# Altium project FMC_Delay_1ns_4Cha.PrjPcb (part 2 of 3)

## Sheet TDC.SchDoc: TDC
size 420 x 297 mm; CheckedBy: -; CompanyName: CERN; DrawnBy: GK; Organization: CERN; Address1: European Organization for Nuclear Research; Address2: CH-1211 Genève 23 - Switzerland; Revision: -; SheetNumber: 7; SheetTotal: 9; EDA_Number: EDA-XXXXX-VX-X; Projet: FMC Delay 1ns 4cha; ModifiedBy: -; CreateDate: XX/XX/XXXX; CheckedDate: -; Title2: Title2; DivGrp: BE-CO; Designer: GK; ModifiedDate: -
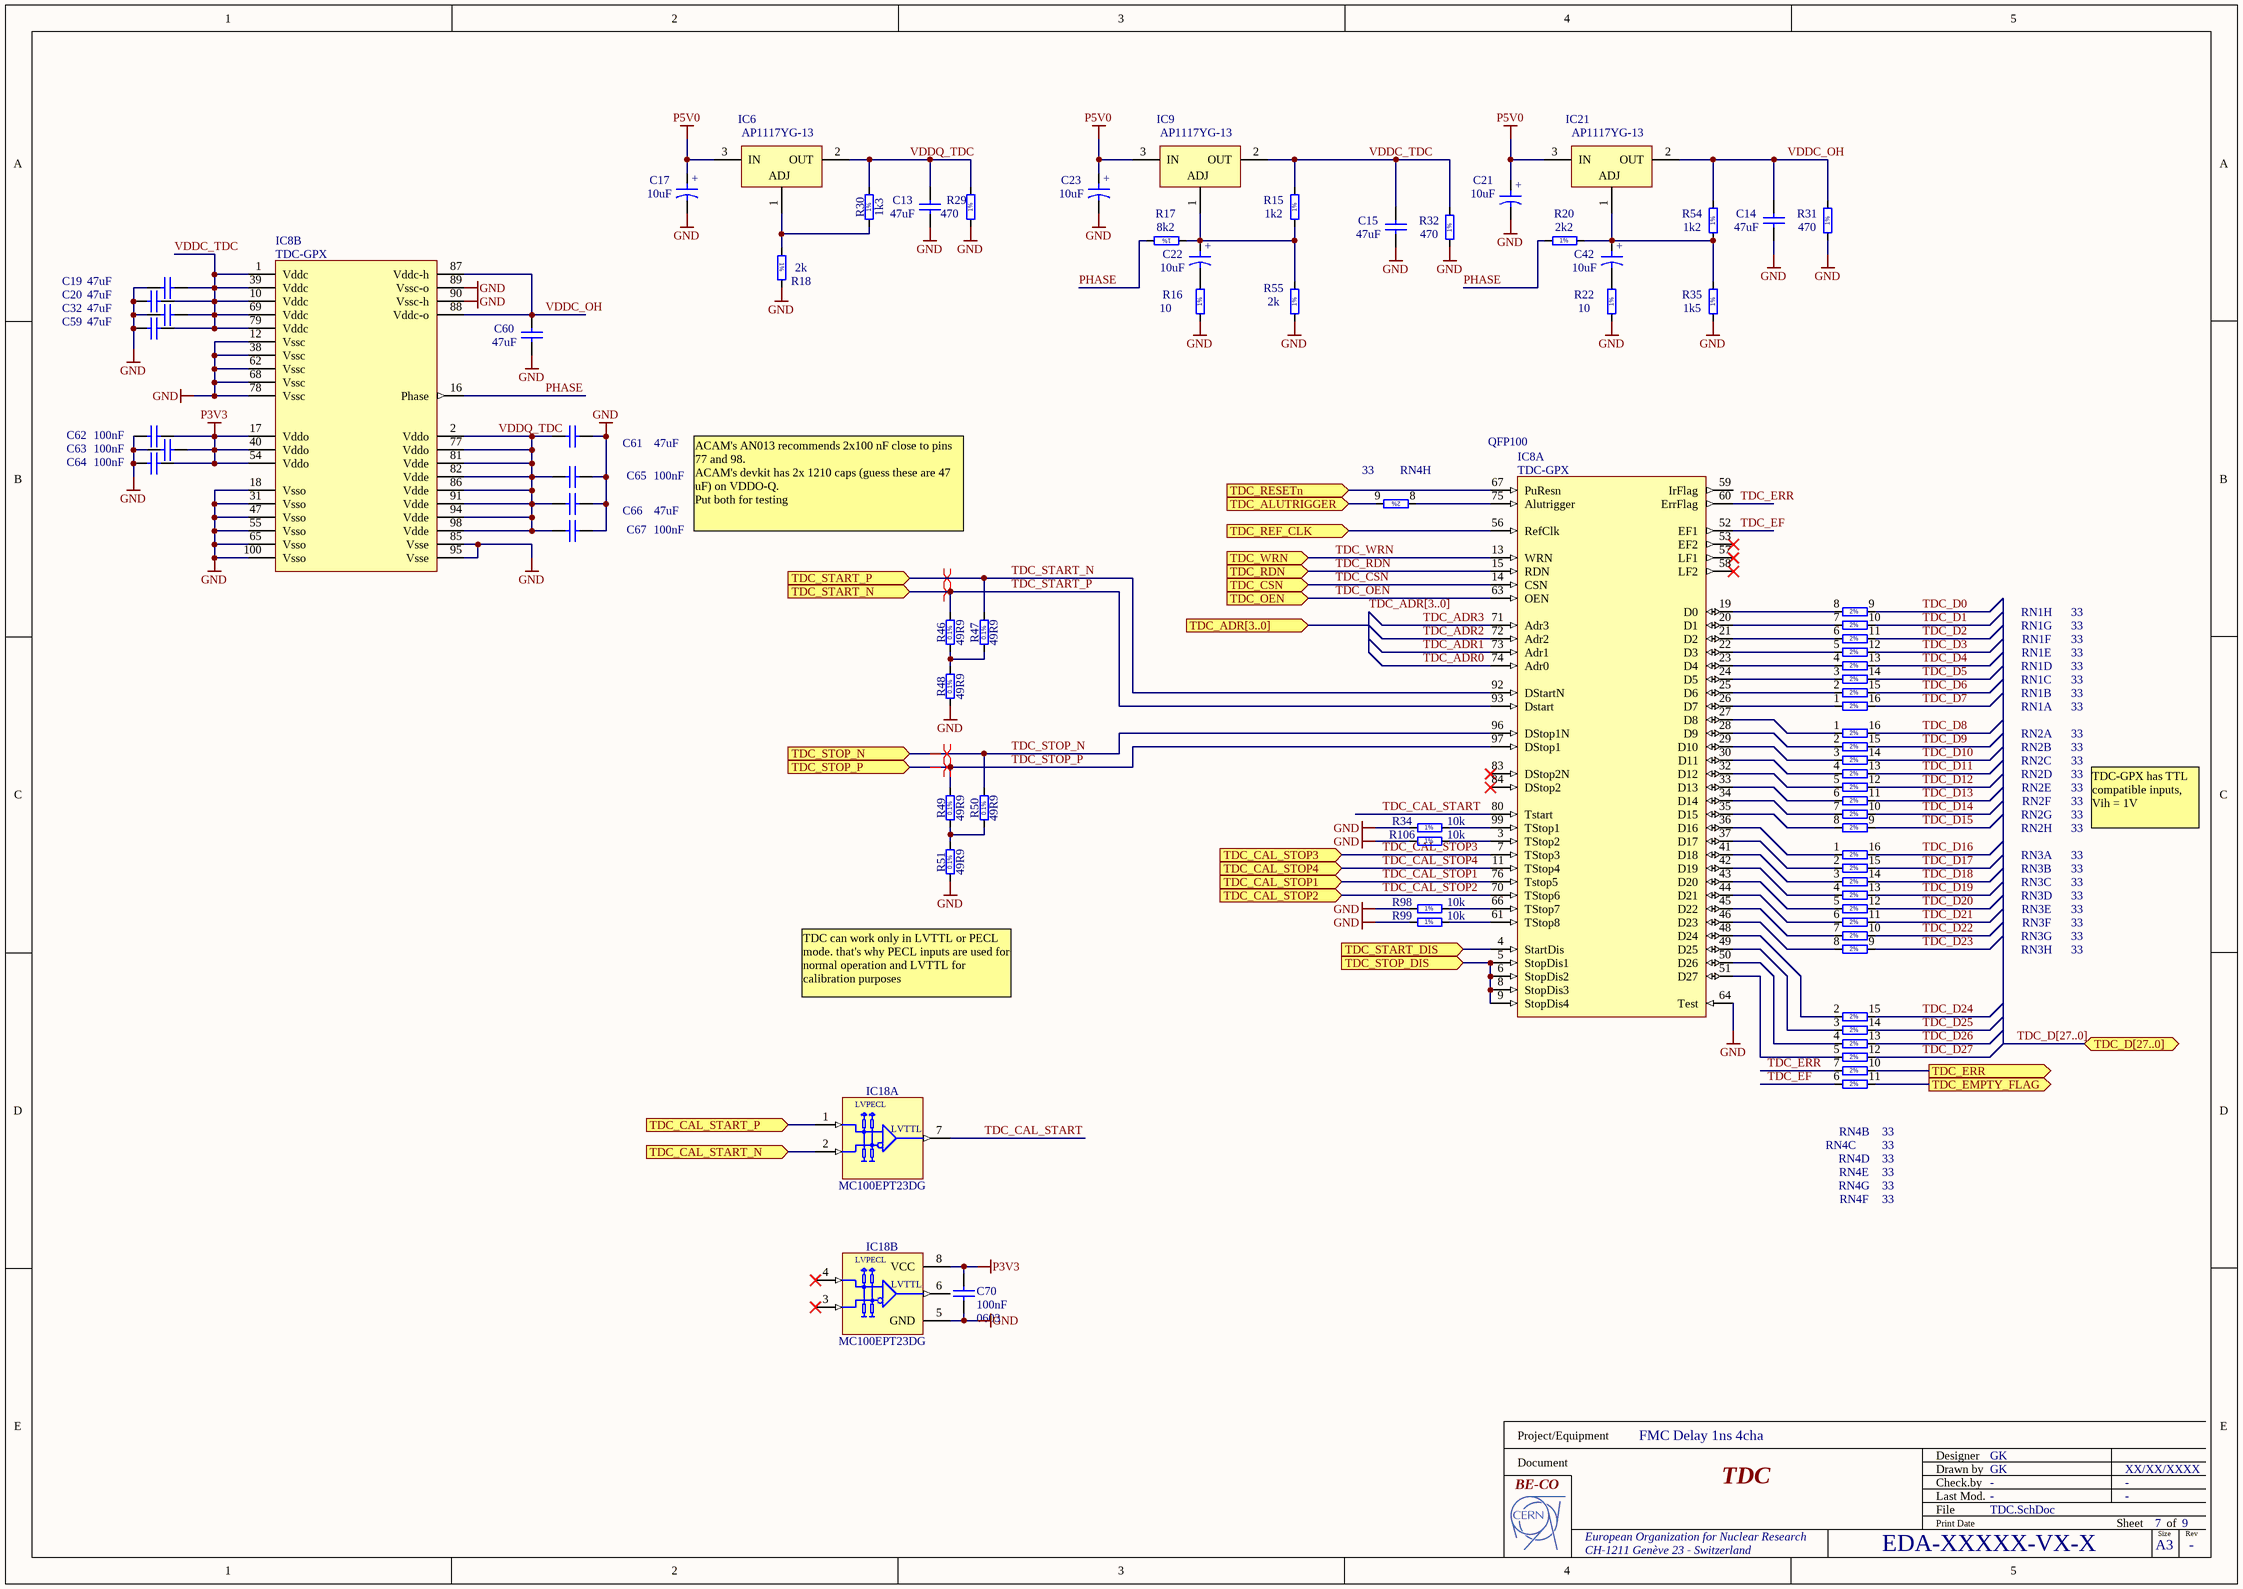
[diagram p4: TDC.SchDoc]

### Parts
(Parts that share a designator on the sheet are numbered #1, #2 ... from top to bottom, then left to right.)
C13  47uF  [CAPC3225X270N]
C14  47uF  [CAPC3225X270N]
C15  47uF  [CAPC3225X270N]
C17  10uF  [CAPMP3216X180N]
C19  47uF  [CAPC3225X270N]
C20  47uF  [CAPC3225X270N]
C21  10uF  [CAPMP3216X180N]
C22  10uF  [CAPMP3216X180N]
C23  10uF  [CAPMP3216X180N]
C32  47uF  [CAPC3225X270N]
C42  10uF  [CAPMP3216X180N]
C59  47uF  [CAPC3225X270N]
C60  47uF  [CAPC3225X270N]
C61  47uF  [CAPC3225X270N]
C62  100nF  [CAPC1608X87N]
C63  100nF  [CAPC1608X87N]
C64  100nF  [CAPC1608X87N]
C65  100nF  [CAPC1608X87N]
C66  47uF  [CAPC3225X270N]
C67  100nF  [CAPC1608X87N]
C70  100nF  Case: 0603  [CAPC1608X87N]
IC6  AP1117YG-13  [SOT89]
IC8  TDC-GPX  Case: QFP100  [QFP50P1600X1600X120-100N]  (parts A,B of 2)
IC9  AP1117YG-13  [SOT89]
IC18  MC100EPT23DG  [SOIC127P600X175-8N]  (parts A,B of 2)
IC21  AP1117YG-13  [SOT89]
R15  1k2  [RESC1608X55N]
R16  10  [RESC1608X55N]
R17  8k2  [RESC1608X55N]
R18  2k  [RESC1608X55N]
R20  2k2  [RESC1608X55N]
R22  10  [RESC1608X55N]
R29#2  470  [RESC2012X60N]
R30  1k3  [RESC1608X55N]
R31#2  470  [RESC2012X60N]
R32#2  470  [RESC2012X60N]
R34  10k  [RESC1608X55N]
R35  1k5  [RESC1608X55N]
R46  49R9  [RESC1608X55N]
R47  49R9  [RESC1608X55N]
R48  49R9  [RESC1608X55N]
R49  49R9  [RESC1608X55N]
R50  49R9  [RESC1608X55N]
R51  49R9  [RESC1608X55N]
R54  1k2  [RESC1608X55N]
R55  2k  [RESC1608X55N]
R98  10k  [RESC1608X55N]
R99  10k  [RESC1608X55N]
R106  10k  [RESC1608X55N]
RN1  33  [RN_YAGEO_YC248]  (parts A,B,C,D,E,F,G,H of 8)
RN2  33  [RN_YAGEO_YC248]  (parts A,B,C,D,E,F,G,H of 8)
RN3  33  [RN_YAGEO_YC248]  (parts A,B,C,D,E,F,G,H of 8)
RN4  33  [RN_YAGEO_YC248]  (parts B,C,D,E,F,G,H of 8)

### Ports
TDC_ADR[3..0] (in), TDC_ALUTRIGGER (in), TDC_CAL_START_N (in), TDC_CAL_START_P (in), TDC_CAL_STOP1 (in), TDC_CAL_STOP2 (in), TDC_CAL_STOP3 (in), TDC_CAL_STOP4 (in), TDC_CSN (in), TDC_D[27..0] (bidir), TDC_EMPTY_FLAG (out), TDC_ERR (out), TDC_OEN (in), TDC_RDN (in), TDC_REF_CLK (in), TDC_RESETn (in), TDC_START_DIS (in), TDC_START_N (in), TDC_START_P (in), TDC_STOP_DIS (in), TDC_STOP_N (in), TDC_STOP_P (in), TDC_WRN (in)

### Nets
GND: C13.1 C14.1 C15.1 C17.2 C19.1 C20.1 C21.2 C23.2 C32.1 C59.1 C60.1 C61.1 C62.2 C63.1 C64.1 C65.2 C66.1 C67.2 C70.1 IC8.12(Vssc) IC8.18(Vsso) IC8.31(Vsso) IC8.38(Vssc) IC8.47(Vsso) IC8.55(Vsso) IC8.62(Vssc) IC8.64(Test) IC8.65(Vsso) IC8.68(Vssc) IC8.78(Vssc) IC8.85(Vsse) IC8.89(Vssc-o) IC8.90(Vssc-h) IC8.95(Vsse) IC8.100(Vsso) IC18.5(GND) R16.1 R18.2 R22.1 R29#2.1 R31#2.1 R32#2.1 R34.1 R35.1 R48.1 R51.1 R55.1 R98.1 R99.1 R106.1
P3V3: C62.1 C63.2 C64.2 C70.2 IC8.17(Vddo) IC8.40(Vddo) IC8.54(Vddo) IC18.8(VCC)
P5V0: C17.1 C21.1 C23.1 IC6.3(IN) IC9.3(IN) IC21.3(IN)
D1_N: IC18.2(~{D0}) ; port TDC_CAL_START_N
D1_P: IC18.1(D0) ; port TDC_CAL_START_P
PHASE: IC8.16(Phase) R17.2 R20.1
RESETn: IC8.67(PuResn) ; port TDC_RESETn
TDC_ADR0: IC8.74(Adr0)
TDC_ADR1: IC8.73(Adr1)
TDC_ADR2: IC8.72(Adr2)
TDC_ADR3: IC8.71(Adr3)
TDC_CAL_START: IC8.80(Tstart) IC18.7(Q0)
TDC_CAL_STOP1: IC8.76(Tstop5) ; port TDC_CAL_STOP1
TDC_CAL_STOP2: IC8.70(TStop6) ; port TDC_CAL_STOP2
TDC_CAL_STOP3: IC8.7(TStop3) ; port TDC_CAL_STOP3
TDC_CAL_STOP4: IC8.11(TStop4) ; port TDC_CAL_STOP4
TDC_CSN: IC8.14(CSN) ; port TDC_CSN
TDC_D0: RN1.9
TDC_D1: RN1.10
TDC_D2: RN1.11
TDC_D3: RN1.12
TDC_D4: RN1.13
TDC_D5: RN1.14
TDC_D6: RN1.15
TDC_D7: RN1.16
TDC_D8: RN2.16
TDC_D9: RN2.15
TDC_D10: RN2.14
TDC_D11: RN2.13
TDC_D12: RN2.12
TDC_D13: RN2.11
TDC_D14: RN2.10
TDC_D15: RN2.9
TDC_D16: RN3.16
TDC_D17: RN3.15
TDC_D18: RN3.14
TDC_D19: RN3.13
TDC_D20: RN3.12
TDC_D21: RN3.11
TDC_D22: RN3.10
TDC_D23: RN3.9
TDC_D24: RN4.15
TDC_D25: RN4.14
TDC_D26: RN4.13
TDC_D27: RN4.12
TDC_EF: IC8.52(EF1) RN4.6
TDC_ERR: IC8.60(ErrFlag) RN4.7
TDC_OEN: IC8.63(OEN) ; port TDC_OEN
TDC_RDN: IC8.15(RDN) ; port TDC_RDN
TDC_START_N: IC8.92(DStartN) R47.2 ; port TDC_START_P
TDC_START_P: IC8.93(Dstart) R46.2 ; port TDC_START_N
TDC_STOP_N: IC8.96(DStop1N) R50.2 ; port TDC_STOP_N
TDC_STOP_P: IC8.97(DStop1) R49.2 ; port TDC_STOP_P
TDC_WRN: IC8.13(WRN) ; port TDC_WRN
VDDC_OH: C14.2 C60.2 IC8.87(Vddc-h) IC8.88(Vddc-o) IC21.2(OUT) R31#2.2 R54.2
VDDC_TDC: C15.2 C19.2 C20.2 C32.2 C59.2 IC8.1(Vddc) IC8.10(Vddc) IC8.39(Vddc) IC8.69(Vddc) IC8.79(Vddc) IC9.2(OUT) R15.2 R32#2.2
VDDQ_TDC: C13.2 C61.2 C65.1 C66.2 C67.1 IC6.2(OUT) IC8.2(Vddo) IC8.77(Vddo) IC8.81(Vdde) IC8.82(Vdde) IC8.86(Vdde) IC8.91(Vdde) IC8.94(Vdde) IC8.98(Vdde) R29#2.2 R30.2
NetC22_1: C22.1 IC9.1(ADJ) R15.1 R17.1 R55.2
NetC22_2: C22.2 R16.2
NetC42_1: C42.1 IC21.1(ADJ) R20.2 R35.2 R54.1
NetC42_2: C42.2 R22.2
NetIC4_46: IC8.56(RefClk) ; port TDC_REF_CLK
NetIC6_1: IC6.1(ADJ) R18.1 R30.1
NetIC8_3: IC8.3(TStop2) R106.2
NetIC8_4: IC8.4(StartDis) ; port TDC_START_DIS
NetIC8_5: IC8.5(StopDis1) IC8.6(StopDis2) IC8.8(StopDis3) IC8.9(StopDis4) ; port TDC_STOP_DIS
NetIC8_19: IC8.19(D0) RN1.8
NetIC8_20: IC8.20(D1) RN1.7
NetIC8_21: IC8.21(D2) RN1.6
NetIC8_22: IC8.22(D3) RN1.5
NetIC8_23: IC8.23(D4) RN1.4
NetIC8_24: IC8.24(D5) RN1.3
NetIC8_25: IC8.25(D6) RN1.2
NetIC8_26: IC8.26(D7) RN1.1
NetIC8_27: IC8.27(D8) RN2.1
NetIC8_28: IC8.28(D9) RN2.2
NetIC8_29: IC8.29(D10) RN2.3
NetIC8_30: IC8.30(D11) RN2.4
NetIC8_32: IC8.32(D12) RN2.5
NetIC8_33: IC8.33(D13) RN2.6
NetIC8_34: IC8.34(D14) RN2.7
NetIC8_35: IC8.35(D15) RN2.8
NetIC8_36: IC8.36(D16) RN3.1
NetIC8_37: IC8.37(D17) RN3.2
NetIC8_41: IC8.41(D18) RN3.3
NetIC8_42: IC8.42(D19) RN3.4
NetIC8_43: IC8.43(D20) RN3.5
NetIC8_44: IC8.44(D21) RN3.6
NetIC8_45: IC8.45(D22) RN3.7
NetIC8_46: IC8.46(D23) RN3.8
NetIC8_48: IC8.48(D24) RN4.2
NetIC8_49: IC8.49(D25) RN4.3
NetIC8_50: IC8.50(D26) RN4.4
NetIC8_51: IC8.51(D27) RN4.5
NetIC8_61: IC8.61(TStop8) R99.2
NetIC8_66: IC8.66(TStop7) R98.2
NetIC8_75: IC8.75(Alutrigger) RN4.8
NetIC8_99: IC8.99(TStop1) R34.2
NetJ6_g18: RN4.9 ; port TDC_ALUTRIGGER
NetJ6_g19: RN4.11 ; port TDC_EMPTY_FLAG
NetR46_1: R46.1 R47.1 R48.2
NetR49_1: R49.1 R50.1 R51.2
NetRN4_10: RN4.10 ; port TDC_ERR

Not connected (* = marked no-connect by the designer): IC8 53(EF2)* 57(LF1)* 58(LF2)* 59(IrFlag) 83(DStop2N)* 84(DStop2)*; IC18 3(~{D0})* 4(D0)* 6(Q0)

### Buses and harness runs
bus TDC_ADR[3..0] = port TDC_ADR[3..0]
bus TDC_D[27..0] = port TDC_D[27..0]

### Layout directives
differential pair: TDC_START_N, TDC_START_P, TDC_STOP_N, TDC_STOP_P

### Notes on the sheet
- ACAM's AN013 recommends 2x100 nF close to pins 77 and 98.
  ACAM's devkit has 2x 1210 caps (guess these are 47 uF) on VDDO-Q.
  Put both for testing
- TDC-GPX has TTL compatible inputs, Vih = 1V
- TDC can work only in LVTTL or PECL mode. that's why PECL inputs are used for normal operation and LVTTL for calibration purposes
- Project/Equipment
- Document
- TDC
- Designer
- Drawn by
- Check.by
- File
- Last Mod.
- Print Date
- Sheet
- Size
- A3
- of
- Rev
- (in symbol CTE3216-18_10UF_10V_10%_LESR1800) +
- (in symbol MC100EPT23DG, part A) LVPECL; LVTTL
- (in symbol MC100EPT23DG, part B) LVPECL; LVTTL
- (in symbol R0603_1K2_1%_0.1W_100PPM) 1%
- (in symbol R0603_1K3_1%_0.1W_100PPM) 1%
- (in symbol R0603_1K5_1%_0.1W_100PPM) 1%
- (in symbol R0603_2K2_1%_0.1W_100PPM) 1%
- (in symbol R0603_2K_1%_0.1W_100PPM) 1%
- (in symbol R0603_8K2_1%_0.1W_100PPM) 1%
- (in symbol R0603_10K_1%_0.1W_100PPM) 1%
- (in symbol R0603_10R_1%_0.1W_200PPM) 1%
- (in symbol R0603_49R9_0.1%_0.063W_10PPM) 0.1%
- (in symbol R0805_470R_1%_0.125W_100PPM) 1%
- (in symbol RN_33R_YAGEO_YC248-JR-0733RL, part A) 2%
- (in symbol RN_33R_YAGEO_YC248-JR-0733RL, part B) 2%
- (in symbol RN_33R_YAGEO_YC248-JR-0733RL, part C) 2%
- (in symbol RN_33R_YAGEO_YC248-JR-0733RL, part D) 2%
- (in symbol RN_33R_YAGEO_YC248-JR-0733RL, part E) 2%
- (in symbol RN_33R_YAGEO_YC248-JR-0733RL, part F) 2%
- (in symbol RN_33R_YAGEO_YC248-JR-0733RL, part G) 2%
- (in symbol RN_33R_YAGEO_YC248-JR-0733RL, part H) 2%

### Library data of the parts
C13-C15 C19 C20 C32 C59-C61 C66 = CC1210_47UF_10V_20%_X5R: Non-polarised capacitor; Part Description: SMD Multilayer Chip Ceramic Capacitor; Manufacturer: GENERIC; Manufacturer1 Part Number: LMK325BJ476MM-T; Voltage: 10V; TC: X5R; Tolerance: ±20%; Table: Capacitors SMD; Part Number: CC1210_47UF_10V_20%_X5R; Component Kind: Standard; Component Type: Standard; Pin Count: 2; Value: 47uF; Status: None; Manufacturer Part Number: CC1210_47UF_10V_20%_X5R; Case: 1210; Mounted: Yes; Socket: No; SMD: Yes; Manufacturer1 Example: TAIYO YUDEN; Manufacturer1 ComponentHeight: 2.7mm; HelpURL: \\cern.ch\dfs\Applications\Altium\Datasheets\CC1210_X5R_TAIYO-YUDEN_HIGH-VALUE.pdf; Author: CERN DEM JLC; CreateDate: 5/4/2011; LatestRevisionDate: 5/4/2011
C17 C21-C23 C42 = CTE3216-18_10UF_10V_10%_LESR1800: Polarised capacitor; Part Description: Low ESR 1R8 Solid Tantalum Chip Capacitor; Manufacturer: GENERIC; Manufacturer1 Part Number: TPSA106K010R1800; Voltage: 10V; Tolerance: ±10%; Table: Capacitors SMD; Part Number: CTE3216-18_10UF_10V_10%_LESR1800; Component Kind: Standard; Component Type: Standard; Pin Count: 2; Value: 10uF; Status: Preferred; Manufacturer Part Number: CTE3216-18_10UF_10V_10%_LESR1800; Case: A; Mounted: Yes; Socket: No; SMD: Yes; Manufacturer1 Example: AVX; Manufacturer1 ComponentHeight: 1.8mm; HelpURL: \\cern.ch\dfs\Applications\Altium\Datasheets\CTE-LESR_AVX_TPS.pdf; Author: CERN DEM JLC; CreateDate: 5/5/2008; LatestRevisionDate: 1/20/2009
C62-C65 C67 C70 = CC0603_100NF_50V_10%_X7R: as C74 on sheet FMC_Delay_1ns_4Cha; Author: CERN DEM JLC; Component Type: Standard; CreateDate: 12/3/2007; HelpURL: \\cern.ch\dfs\Applications\Altium\Datasheets\CC0603_X7R_PHYCOMP.pdf; LatestRevisionDate: 12/3/2007; Manufacturer1 ComponentHeight: 0.87mm; Manufacturer1 Example: PHYCOMP; Manufacturer Part Number: CC0603_100NF_50V_10%_X7R; Mounted: Yes; Pin Count: 2; SMD: Yes; Socket: No; Status: Preferred; Value: 100nF; Part Number: CC0603_100NF_50V_10%_X7R; Component Kind: Standard
  C62-C65 C67: Case: 0603
IC6 IC9 IC21 = AP1117YG-13: 3-Terminal Regulator 1=Adj 2=OUT 3=IN; Part Description: 1.25V To 5V, 1A Low-Dropout Positive Adjustable Voltage Regulator; Manufacturer: DIODES INCORPORATED; Table: Regulators; Part Number: AP1117YG-13; Component Kind: Standard; Component Type: Standard; Device: AP1117YG-13; PackageDescription: SOT89-3, 3-Leads, Body 2.48x4.5mm; Manufacturer Part Number: AP1117YG-13; Pin Count: 3; Case: SOT89; Mounted: Yes; Socket: No; SMD: Yes; ComponentHeight: 1.6mm; HelpURL: \\cern.ch\dfs\Applications\Altium\Datasheets\AP1117YG-13.pdf; Author: CERN DEM JLC; CreateDate: 5/4/2011; LatestRevisionDate: 5/4/2011
IC8 = TDC-GPX: Multifunctional High-End Time-to-Digital Converter (4 different operation modes, 81 ps up to 10 ps resolution); Manufacturer: ACAM MESS-ELECTRONIC; Table: Analog & Interface; Part Number: TDC-GPX; Component Kind: Standard; Component Type: Standard; Device: TDC-GPX; PackageDescription: QFP,0.50mm pitch,square;100 pin,14.00mm L X 14.00mm W X 1.20mm H body (w/thermal tab), IPC Medium Density; Part Description: Multifunctional High-End Time-to-Digital Converter (4 different operation modes, 81 ps up to 10 ps resolution); Manufacturer Part Number: TDC-GPX; Pin Count: 100; Mounted: Yes; Socket: No; SMD: Yes; ComponentHeight: 1.2mm; Author: CERN DEM JLC; HelpURL: \\cern.ch\dfs\Applications\Altium\Datasheets\TDC-GPX.pdf; CreateDate: 7/5/2010; LatestRevisionDate: 7/5/2010
IC18 = MC100EPT23DG: 3.3V Dual Differential LVPECL/LVDS/CML  to LVTTL/LVCMOS Translator; Manufacturer: ON SEMICONDUCTOR; Table: Standard Logic; Part Number: MC100EPT23DG; Component Kind: Standard; Component Type: Standard; Device: MC100EPT23DG; PackageDescription: SOIC 8, Pitch 1.27mm - Body 4x5mm, IPC Medium Density; Part Description: 3.3V Dual Differential LVPECL/LVDS/CML  to LVTTL/LVCMOS Translator; Manufacturer Part Number: MC100EPT23DG; Pin Count: 8; Case: SOIC8; Mounted: Yes; Socket: No; SMD: Yes; ComponentHeight: 1.75mm; Author: CERN DEM JLC; HelpURL: \\cern.ch\dfs\Applications\Altium\Datasheets\MC100EPT23DG.pdf; CreateDate: 1/13/2011; LatestRevisionDate: 1/13/2011
R15 R54 = R0603_1K2_1%_0.1W_100PPM: Resistor - 1%; Part Description: General Purpose Thick Film Chip Resistor; Manufacturer: GENERIC; Manufacturer1 Part Number: NRC06F1201TRF; Power: 0.1W; TC: ±100ppm/°C; Table: Resistors SMD; Part Number: R0603_1K2_1%_0.1W_100PPM; Component Kind: Standard; Component Type: Standard; Pin Count: 2; Value: 1k2; Status: Preferred; Tolerance: ±1%; Manufacturer Part Number: R0603_1K2_1%_0.1W_100PPM; Case: 0603; Mounted: Yes; Socket: No; SMD: Yes; Manufacturer1 Example: NIC COMPONENT; Manufacturer1 ComponentHeight: 0.55mm; HelpURL: \\cern.ch\dfs\Applications\Altium\Datasheets\R0603_NIC_NRC.pdf; Author: CERN DEM JLC; CreateDate: 12/3/2007; LatestRevisionDate: 3/13/2008
R16 R22 = R0603_10R_1%_0.1W_200PPM: Resistor - 1%; Part Description: General Purpose Thick Film Chip Resistor; Manufacturer: GENERIC; Manufacturer1 Part Number: NRC06F10R0TRF; Power: 0.1W; TC: ±200ppm/°C; Table: Resistors SMD; Part Number: R0603_10R_1%_0.1W_200PPM; Component Kind: Standard; Component Type: Standard; Pin Count: 2; Value: 10; Status: Preferred; Tolerance: ±1%; Manufacturer Part Number: R0603_10R_1%_0.1W_200PPM; Case: 0603; Mounted: Yes; Socket: No; SMD: Yes; Manufacturer1 Example: NIC COMPONENT; Manufacturer1 ComponentHeight: 0.55mm; HelpURL: \\cern.ch\dfs\Applications\Altium\Datasheets\R0603_NIC_NRC.pdf; Author: CERN DEM JLC; CreateDate: 12/3/2007; LatestRevisionDate: 6/24/2009
R17 = R0603_8K2_1%_0.1W_100PPM: Resistor - 1%; Part Description: General Purpose Thick Film Chip Resistor; Manufacturer: GENERIC; Manufacturer1 Part Number: NRC06F8201TRF; Power: 0.1W; TC: ±100ppm/°C; Table: Resistors SMD; Part Number: R0603_8K2_1%_0.1W_100PPM; Component Kind: Standard; Component Type: Standard; Pin Count: 2; Value: 8k2; Status: Preferred; Tolerance: ±1%; Manufacturer Part Number: R0603_8K2_1%_0.1W_100PPM; Case: 0603; Mounted: Yes; Socket: No; SMD: Yes; Manufacturer1 Example: NIC COMPONENT; Manufacturer1 ComponentHeight: 0.55mm; HelpURL: \\cern.ch\dfs\Applications\Altium\Datasheets\R0603_NIC_NRC.pdf; Author: CERN DEM JLC; CreateDate: 12/3/2007; LatestRevisionDate: 3/13/2008
R18 R55 = R0603_2K_1%_0.1W_100PPM: Resistor - 1%; Part Description: General Purpose Thick Film Chip Resistor; Manufacturer: GENERIC; Manufacturer1 Part Number: NRC06F2001TRF; Power: 0.1W; TC: ±100ppm/°C; Table: Resistors SMD; Part Number: R0603_2K_1%_0.1W_100PPM; Component Kind: Standard; Component Type: Standard; Pin Count: 2; Value: 2k; Status: Preferred; Tolerance: ±1%; Manufacturer Part Number: R0603_2K_1%_0.1W_100PPM; Case: 0603; Mounted: Yes; Socket: No; SMD: Yes; Manufacturer1 Example: NIC COMPONENT; Manufacturer1 ComponentHeight: 0.55mm; HelpURL: \\cern.ch\dfs\Applications\Altium\Datasheets\R0603_NIC_NRC.pdf; Author: CERN DEM JLC; CreateDate: 12/3/2007; LatestRevisionDate: 3/13/2008
R20 = R0603_2K2_1%_0.1W_100PPM: Resistor - 1%; Part Description: General Purpose Thick Film Chip Resistor; Manufacturer: GENERIC; Manufacturer1 Part Number: NRC06F2201TRF; Power: 0.1W; TC: ±100ppm/°C; Table: Resistors SMD; Part Number: R0603_2K2_1%_0.1W_100PPM; Component Kind: Standard; Component Type: Standard; Pin Count: 2; Value: 2k2; Status: Preferred; Tolerance: ±1%; Manufacturer Part Number: R0603_2K2_1%_0.1W_100PPM; Case: 0603; Mounted: Yes; Socket: No; SMD: Yes; Manufacturer1 Example: NIC COMPONENT; Manufacturer1 ComponentHeight: 0.55mm; HelpURL: \\cern.ch\dfs\Applications\Altium\Datasheets\R0603_NIC_NRC.pdf; Author: CERN DEM JLC; CreateDate: 12/3/2007; LatestRevisionDate: 3/13/2008
R29#2 R31#2 R32#2 = R0805_470R_1%_0.125W_100PPM: Resistor - 1%; Part Description: General Purpose Thick Film Chip Resistor; Manufacturer: GENERIC; Manufacturer1 Part Number: NRC10F4700TRF; Power: 0.125W; TC: ±100ppm/°C; Table: Resistors SMD; Part Number: R0805_470R_1%_0.125W_100PPM; Component Kind: Standard; Component Type: Standard; Pin Count: 2; Value: 470; Status: Preferred; Tolerance: ±1%; Manufacturer Part Number: R0805_470R_1%_0.125W_100PPM; Case: 0805; Mounted: Yes; Socket: No; SMD: Yes; Manufacturer1 Example: NIC COMPONENT; Manufacturer1 ComponentHeight: 0.6mm; HelpURL: \\cern.ch\dfs\Applications\Altium\Datasheets\R0805_NIC_NRC.pdf; Author: CERN DEM JLC; CreateDate: 12/3/2007; LatestRevisionDate: 3/13/2008
R30 = R0603_1K3_1%_0.1W_100PPM: Resistor - 1%; Part Description: General Purpose Thick Film Chip Resistor; Manufacturer: GENERIC; Manufacturer1 Part Number: NRC06F1301TRF; Power: 0.1W; TC: ±100ppm/°C; Table: Resistors SMD; Part Number: R0603_1K3_1%_0.1W_100PPM; Component Kind: Standard; Component Type: Standard; Pin Count: 2; Value: 1k3; Status: Preferred; Tolerance: ±1%; Manufacturer Part Number: R0603_1K3_1%_0.1W_100PPM; Case: 0603; Mounted: Yes; Socket: No; SMD: Yes; Manufacturer1 Example: NIC COMPONENT; Manufacturer1 ComponentHeight: 0.55mm; HelpURL: \\cern.ch\dfs\Applications\Altium\Datasheets\R0603_NIC_NRC.pdf; Author: CERN DEM JLC; CreateDate: 12/3/2007; LatestRevisionDate: 3/13/2008
R34 R98 R99 R106 = R0603_10K_1%_0.1W_100PPM: Resistor - 1%; Part Description: General Purpose Thick Film Chip Resistor; Manufacturer: GENERIC; Manufacturer1 Part Number: NRC06F1002TRF; Power: 0.1W; TC: ±100ppm/°C; Table: Resistors SMD; Part Number: R0603_10K_1%_0.1W_100PPM; Component Kind: Standard; Component Type: Standard; Pin Count: 2; Value: 10k; Status: Preferred; Tolerance: ±1%; Manufacturer Part Number: R0603_10K_1%_0.1W_100PPM; Case: 0603; Mounted: Yes; Socket: No; SMD: Yes; Manufacturer1 Example: NIC COMPONENT; Manufacturer1 ComponentHeight: 0.55mm; HelpURL: \\cern.ch\dfs\Applications\Altium\Datasheets\R0603_NIC_NRC.pdf; Author: CERN DEM JLC; CreateDate: 12/3/2007; LatestRevisionDate: 3/13/2008
R35 = R0603_1K5_1%_0.1W_100PPM: Resistor - 1%; Part Description: General Purpose Thick Film Chip Resistor; Manufacturer: GENERIC; Manufacturer1 Part Number: NRC06F1501TRF; Power: 0.1W; TC: ±100ppm/°C; Table: Resistors SMD; Part Number: R0603_1K5_1%_0.1W_100PPM; Component Kind: Standard; Component Type: Standard; Pin Count: 2; Value: 1k5; Status: Preferred; Tolerance: ±1%; Manufacturer Part Number: R0603_1K5_1%_0.1W_100PPM; Case: 0603; Mounted: Yes; Socket: No; SMD: Yes; Manufacturer1 Example: NIC COMPONENT; Manufacturer1 ComponentHeight: 0.55mm; HelpURL: \\cern.ch\dfs\Applications\Altium\Datasheets\R0603_NIC_NRC.pdf; Author: CERN DEM JLC; CreateDate: 12/3/2007; LatestRevisionDate: 3/13/2008
R46-R51 = R0603_49R9_0.1%_0.063W_10PPM: Resistor - 0.1%; Part Description: Thin Film Chip Resistor; Manufacturer: GENERIC; Manufacturer1 Part Number: RN73C1J49R9BTDF; Power: 0.063W; TC: ±10ppm; Table: Resistors SMD; Part Number: R0603_49R9_0.1%_0.063W_10PPM; Component Kind: Standard; Component Type: Standard; Pin Count: 2; Value: 49R9; Status: Not recommended; Tolerance: ±0.1%; Manufacturer Part Number: R0603_49R9_0.1%_0.063W_10PPM; Case: 0603; Mounted: Yes; Socket: No; SMD: Yes; Manufacturer1 Example: TYCO HOLSWORTHY; Manufacturer1 ComponentHeight: 0.5mm; HelpURL: \\cern.ch\dfs\Applications\Altium\Datasheets\R0603_Tyco_RN73.pdf; Author: CERN DEM JLC; CreateDate: 12/3/2007; LatestRevisionDate: 3/13/2008
RN1-RN4 = RN_33R_YAGEO_YC248-JR-0733RL: DIL16 Resistor Network 8 Isolated Resistor 5%; Part Description: Chip Resistor Array , 8 Isolated Resistor (Side Convex Terminal), YC248 Serie; Manufacturer: YAGEO; Power: 0.062W; TC: ±200ppm/°C; Table: Resistor Networks SMD; Part Number: RN_33R_YAGEO_YC248-JR-0733RL; Component Kind: Standard; Component Type: Standard; Pin Count: 16; Value: 33; Tolerance: ±5%; Manufacturer Part Number: YC248-JR-0733RL; Mounted: Yes; Socket: No; SMD: Yes; ComponentHeight: 0.55mm; HelpURL: \\cern.ch\dfs\Applications\Altium\Datasheets\RN_YAGEO_YC248.pdf; Author: CERN DEM JLC; CreateDate: 1/13/2011; LatestRevisionDate: 1/13/2011

## Sheet CHANNEL_DELAY.SchDoc: Programmable delay
size 297 x 209 mm; CheckedBy: -; CompanyName: CERN; DrawnBy: GK; Organization: CERN; Address1: European Organization for Nuclear Research; Address2: CH-1211 Geneve 23 - Switzerland; Revision: -; SheetNumber: 8; SheetTotal: 9; EDA_Number: EDA-XXXXX-VX-X; Projet: FMC Delay 1ns 4cha; ModifiedBy: -; CreateDate: XX/XX/XXXX; CheckedDate: -; Title2: Title2; DivGrp: BE-CO; Designer: GK; ModifiedDate: -
Used 2 times, as channels U_CHANNEL_DELAY, U_CHANNEL_DELAY. Parts and nets are listed once, with the designators drawn on the sheet.
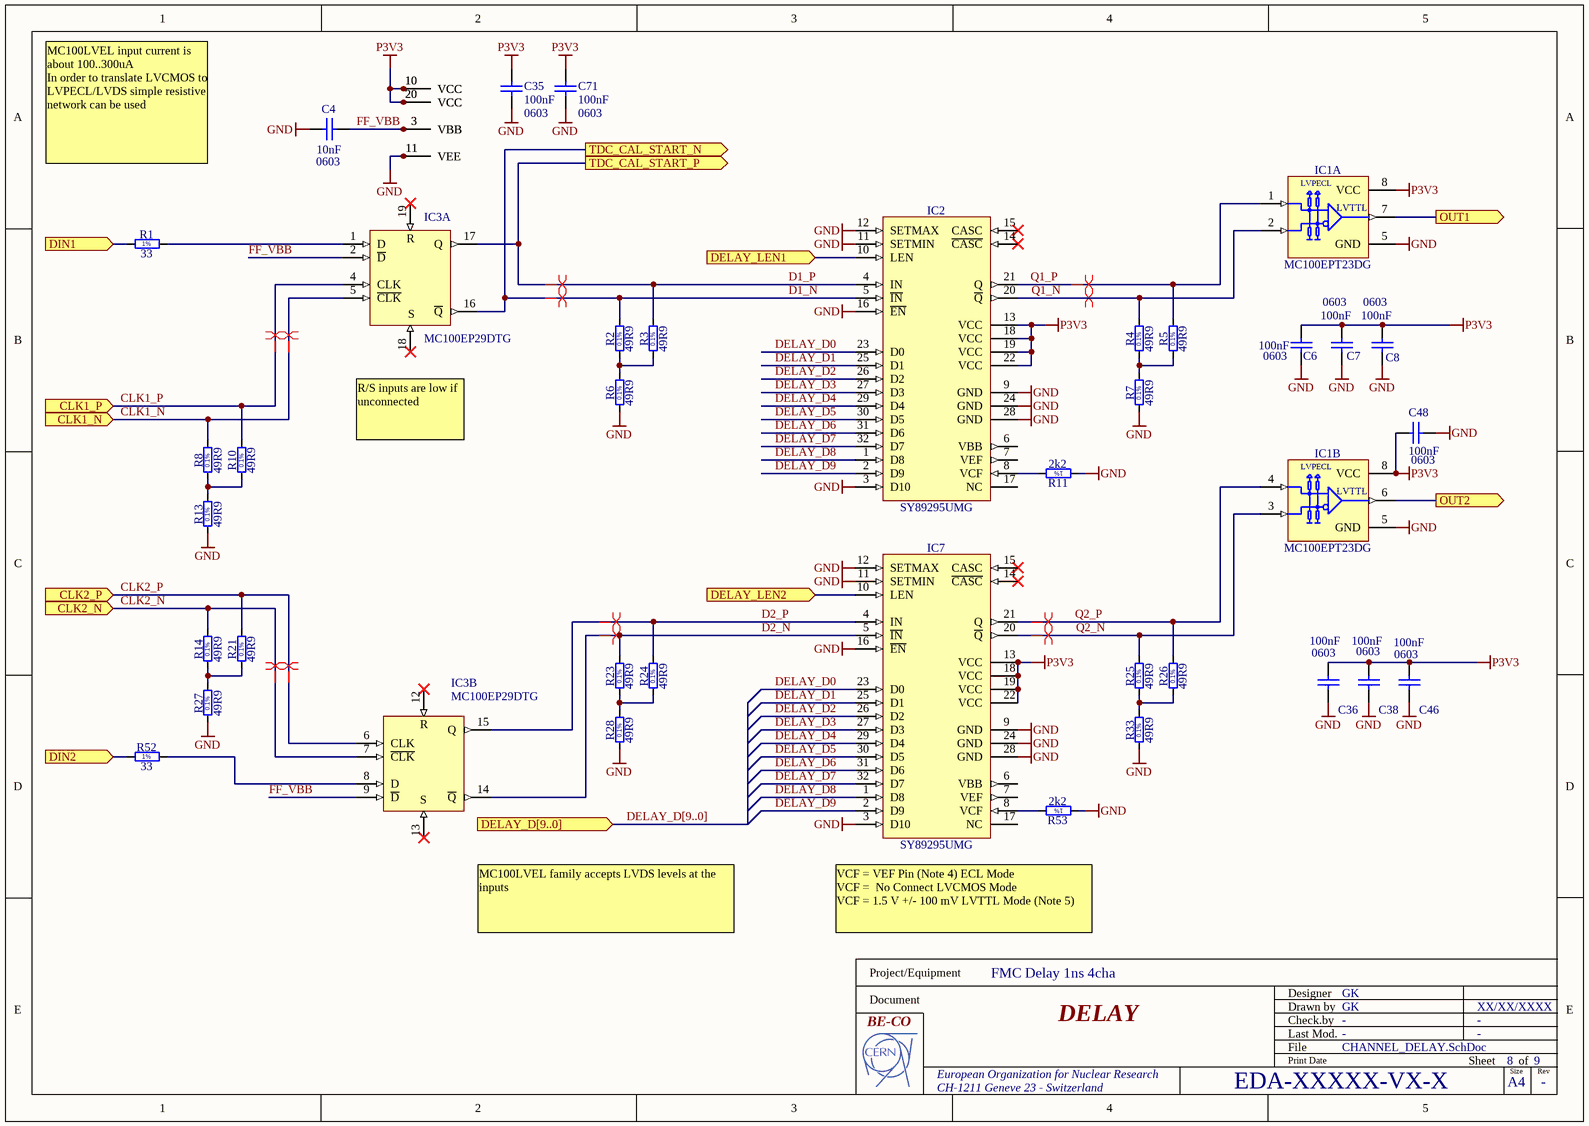
[diagram p5: CHANNEL_DELAY.SchDoc]

### Parts
C4  10nF  Case: 0603  [CAPC1608X87N]
C6  100nF  Case: 0603  [CAPC1608X87N]
C7  100nF  Case: 0603  [CAPC1608X87N]
C8  100nF  Case: 0603  [CAPC1608X87N]
C35  100nF  Case: 0603  [CAPC1608X87N]
C36  100nF  Case: 0603  [CAPC1608X87N]
C38  100nF  Case: 0603  [CAPC1608X87N]
C46  100nF  Case: 0603  [CAPC1608X87N]
C48  100nF  Case: 0603  [CAPC1608X87N]
C71  100nF  Case: 0603  [CAPC1608X87N]
IC1  MC100EPT23DG  [SOIC127P600X175-8N]  (parts A,B of 2)
IC2  SY89295UMG  [QFN50P500X500X90-33N-S320]
IC3  MC100EP29DTG  [SOP65P640X120-20N]  (parts A,B of 2)
IC7  SY89295UMG  [QFN50P500X500X90-33N-S320]
R1  33  [RESC1608X55N]
R2  49R9  [RESC1608X55N]
R3  49R9  [RESC1608X55N]
R4  49R9  [RESC1608X55N]
R5  49R9  [RESC1608X55N]
R6  49R9  [RESC1608X55N]
R7  49R9  [RESC1608X55N]
R8  49R9  [RESC1608X55N]
R10  49R9  [RESC1608X55N]
R11  2k2  [RESC1608X55N]
R13  49R9  [RESC1608X55N]
R14  49R9  [RESC1608X55N]
R21  49R9  [RESC1608X55N]
R23  49R9  [RESC1608X55N]
R24  49R9  [RESC1608X55N]
R25  49R9  [RESC1608X55N]
R26  49R9  [RESC1608X55N]
R27  49R9  [RESC1608X55N]
R28  49R9  [RESC1608X55N]
R33  49R9  [RESC1608X55N]
R52  33  [RESC1608X55N]
R53  2k2  [RESC1608X55N]

### Ports
CLK1_N (in), CLK1_P (in), CLK2_N (in), CLK2_P (in), DELAY_D[9..0] (in), DELAY_LEN1 (in), DELAY_LEN2 (in), DIN1 (in), DIN2 (in), OUT1 (out), OUT2 (out), TDC_CAL_START_N (out), TDC_CAL_START_P (out)

### Nets
FF_VBB: C4.1 IC3.2(~{D}) IC3.3(VBB) IC3.9(~{D})
GND: C4.2 C6.2 C7.2 C8.2 C35.1 C36.2 C38.2 C46.2 C48.2 C71.1 IC1.5(GND) IC2.3(D10) IC2.9(GND) IC2.11(SETMIN) IC2.12(SETMAX) IC2.16(~{EN}) IC2.24(GND) IC2.28(GND) IC3.11(VEE) IC7.3(D10) IC7.9(GND) IC7.11(SETMIN) IC7.12(SETMAX) IC7.16(~{EN}) IC7.24(GND) IC7.28(GND) R6.1 R7.1 R11.1 R13.1 R27.1 R28.1 R33.1 R53.1
P3V3: C6.1 C7.1 C8.1 C35.2 C36.1 C38.1 C46.1 C48.1 C71.2 IC1.8(VCC) IC2.13(VCC) IC2.18(VCC) IC2.19(VCC) IC2.22(VCC) IC3.10(VCC) IC3.20(VCC) IC7.13(VCC) IC7.18(VCC) IC7.19(VCC) IC7.22(VCC)  [also labelled VCC]
CLK1_N: IC3.5(~{CLK}) R8.2 ; port CLK1_N
CLK1_P: IC3.4(CLK) R10.2 ; port CLK1_P
CLK2_N: IC3.7(~{CLK}) R14.2 ; port CLK2_N
CLK2_P: IC3.6(CLK) R21.2 ; port CLK2_P
D1_N: IC2.5(~{IN}) IC3.16(~{Q}) R2.2 ; port TDC_CAL_START_N
D1_P: IC2.4(IN) IC3.17(Q) R3.2 ; port TDC_CAL_START_P
D2_N: IC3.14(~{Q}) IC7.5(~{IN}) R23.2
D2_P: IC3.15(Q) IC7.4(IN) R24.2
DELAY_D0: IC2.23(D0) IC7.23(D0)
DELAY_D1: IC2.25(D1) IC7.25(D1)
DELAY_D2: IC2.26(D2) IC7.26(D2)
DELAY_D3: IC2.27(D3) IC7.27(D3)
DELAY_D4: IC2.29(D4) IC7.29(D4)
DELAY_D5: IC2.30(D5) IC7.30(D5)
DELAY_D6: IC2.31(D6) IC7.31(D6)
DELAY_D7: IC2.32(D7) IC7.32(D7)
DELAY_D8: IC2.1(D8) IC7.1(D8)
DELAY_D9: IC2.2(D9) IC7.2(D9)
DELAY_LEN1: IC2.10(LEN) ; port DELAY_LEN1
DELAY_LEN2: IC7.10(LEN) ; port DELAY_LEN2
DIN1: R1.1 ; port DIN1
DIN2: R52.1 ; port DIN2
OUT1: IC1.7(Q0) ; port OUT1
OUT2: IC1.6(Q0) ; port OUT2
Q1_N: IC1.2(~{D0}) IC2.20(~{Q}) R4.2
Q1_P: IC1.1(D0) IC2.21(Q) R5.2
Q2_N: IC1.3(~{D0}) IC7.20(~{Q}) R25.2
Q2_P: IC1.4(D0) IC7.21(Q) R26.2
NetIC2_8: IC2.8(VCF) R11.2
NetIC3_1: IC3.1(D) R1.2
NetIC3_8: IC3.8(D) R52.2
NetIC7_8: IC7.8(VCF) R53.2
NetR2_1: R2.1 R3.1 R6.2
NetR4_1: R4.1 R5.1 R7.2
NetR8_1: R8.1 R10.1 R13.2
NetR14_1: R14.1 R21.1 R27.2
NetR23_1: R23.1 R24.1 R28.2
NetR25_1: R25.1 R26.1 R33.2

Not connected (* = marked no-connect by the designer): IC2 6(VBB) 7(VEF) 14(~{CASC})* 15(CASC)* 17(NC); IC3 12(R)* 13(S)* 18(S)* 19(R)*; IC7 6(VBB) 7(VEF) 14(~{CASC})* 15(CASC)* 17(NC)

### Channels
U_CHANNEL_DELAY: designators end in A; ports CLK1_N=CLK1_N CLK1_P=CLK1_P CLK2_N=CLK2_N CLK2_P=CLK2_P DELAY_LEN1=DELAY_LEN1 DELAY_LEN2=DELAY_LEN2 DIN1=DIN1 DIN2=DIN2 OUT1=NetIC1A_7 OUT2=NetIC1A_6 TDC_CAL_START_N=D1_N_U_CHANNEL_DELAY TDC_CAL_START_P=D1_P_U_CHANNEL_DELAY
U_CHANNEL_DELAY: designators end in B; ports CLK1_N=CLK1_N CLK1_P=CLK1_P CLK2_N=CLK2_N CLK2_P=CLK2_P DELAY_LEN1=DELAY_LEN3 DELAY_LEN2=DELAY_LEN4 DIN1=DIN3 DIN2=DIN4 OUT1=NetIC1B_7 OUT2=NetIC1B_6 TDC_CAL_START_N=D1_N TDC_CAL_START_P=D1_P

### Buses and harness runs
bus DELAY_D[9..0] = port DELAY_D[9..0]

### Layout directives
differential pair: CLK1_N, CLK1_P, CLK2_N, CLK2_P, D1_N_U_CHANNEL_DELAY, D1_P_U_CHANNEL_DELAY, D2_N_U_CHANNEL_DELAY, D2_P_U_CHANNEL_DELAY, Q1_N_U_CHANNEL_DELAY, Q1_P_U_CHANNEL_DELAY, Q2_N_U_CHANNEL_DELAY, Q2_P_U_CHANNEL_DELAY

### Notes on the sheet
- MC100LVEL input current is about 100..300uA
  In order to translate LVCMOS to LVPECL/LVDS simple resistive network can be used
- R/S inputs are low if unconnected
- MC100LVEL family accepts LVDS levels at the inputs
- VCF = VEF Pin (Note 4) ECL Mode
  VCF =  No Connect LVCMOS Mode
  VCF = 1.5 V +/- 100 mV LVTTL Mode (Note 5)
- Project/Equipment
- Document
- DELAY
- Designer
- Drawn by
- Check.by
- File
- Last Mod.
- Print Date
- Sheet
- Size
- A4
- of
- Rev
- (in symbol MC100EPT23DG, part A) LVPECL; LVTTL
- (in symbol MC100EPT23DG, part B) LVPECL; LVTTL
- (in symbol R0603_2K2_1%_0.1W_100PPM) 1%
- (in symbol R0603_33R_1%_0.1W_100PPM) 1%
- (in symbol R0603_49R9_0.1%_0.063W_10PPM) 0.1%

### Library data of the parts
C4 = CC0603_10NF_50V_10%_X7R: Non-polarised capacitor; Part Description: SMD Multilayer Chip Ceramic Capacitor; Manufacturer: GENERIC; Manufacturer1 Part Number: 223858615636; Voltage: 50V; TC: X7R; Tolerance: ±10%; Table: Capacitors SMD; Part Number: CC0603_10NF_50V_10%_X7R; Component Kind: Standard; Component Type: Standard; Pin Count: 2; Value: 10nF; Status: Preferred; Manufacturer Part Number: CC0603_10NF_50V_10%_X7R; Mounted: Yes; Socket: No; SMD: Yes; Manufacturer1 Example: PHYCOMP; Manufacturer1 ComponentHeight: 0.87mm; HelpURL: \\cern.ch\dfs\Applications\Altium\Datasheets\CC0603_X7R_PHYCOMP.pdf; Author: CERN DEM JLC; CreateDate: 12/3/2007; LatestRevisionDate: 12/3/2007
C6-C8 C35 C36 C38 C46 C48 C71 = CC0603_100NF_50V_10%_X7R: as C74 on sheet FMC_Delay_1ns_4Cha; Author: CERN DEM JLC; Component Type: Standard; CreateDate: 12/3/2007; HelpURL: \\cern.ch\dfs\Applications\Altium\Datasheets\CC0603_X7R_PHYCOMP.pdf; LatestRevisionDate: 12/3/2007; Manufacturer1 ComponentHeight: 0.87mm; Manufacturer1 Example: PHYCOMP; Manufacturer Part Number: CC0603_100NF_50V_10%_X7R; Mounted: Yes; Pin Count: 2; SMD: Yes; Socket: No; Status: Preferred; Value: 100nF; Part Number: CC0603_100NF_50V_10%_X7R; Component Kind: Standard
IC1 = MC100EPT23DG: as IC18 on sheet TDC; Part Number: MC100EPT23DG; Component Kind: Standard; Component Type: Standard; Device: MC100EPT23DG; PackageDescription: SOIC 8, Pitch 1.27mm - Body 4x5mm, IPC Medium Density; Part Description: 3.3V Dual Differential LVPECL/LVDS/CML  to LVTTL/LVCMOS Translator; Manufacturer Part Number: MC100EPT23DG; Pin Count: 8; Case: SOIC8; Mounted: Yes; Socket: No; SMD: Yes; ComponentHeight: 1.75mm; Author: CERN DEM JLC; HelpURL: \\cern.ch\dfs\Applications\Altium\Datasheets\MC100EPT23DG.pdf; CreateDate: 1/13/2011; LatestRevisionDate: 1/13/2011
IC2 IC7 = SY89295UMG: 2.5V/3.3V 1.5GHz Precision LVPECL Programmable Delay; Manufacturer: MICREL; Table: Analog & Interface; Part Number: SY89295UMG; Component Kind: Standard; Component Type: Standard; Device: SY89295UMG; PackageDescription: QFN, (MO-220-VHHD-4) 0.50mm pitch,square; 8 pin X 8 pin, 5mm X 5mm X 1.00mm H body (w/thermal tab 3.2 X 3.2mm),  IPC Medium Density; Part Description: 2.5V/3.3V 1.5GHz Precision LVPECL Programmable Delay; Manufacturer Part Number: SY89295UMG; Pin Count: 32; Case: QFN32; Mounted: Yes; Socket: No; SMD: Yes; ComponentHeight: 1mm; Author: CERN DEM JLC; HelpURL: \\cern.ch\dfs\Applications\Altium\Datasheets\SY89295UMG.pdf; CreateDate: 5/4/2011; LatestRevisionDate: 5/4/2011
IC3 = MC100EP29DTG: 3.3V/5V ECL Dual Differential Data and Clock D Flip-Flop With Set and Reset; Manufacturer: ON SEMICONDUCTOR; Table: Standard Logic; Part Number: MC100EP29DTG; Component Kind: Standard; Component Type: Standard; Device: MC100EP29DTG; PackageDescription: SOP, 20-Leads, Body 6.5x4.4mm, Pitch 0.65mm, IPC Medium Density; Part Description: 3.3V/5V ECL Dual Differential Data And Clock D Flip-Flop With Set and Reset; Manufacturer Part Number: MC100EP29DTG; Pin Count: 20; Case: TSSOP20; Mounted: Yes; Socket: No; SMD: Yes; ComponentHeight: 1.2mm; Author: CERN DEM JLC; HelpURL: \\cern.ch\dfs\Applications\Altium\Datasheets\MC100EP29DTG.pdf; CreateDate: 1/12/2011; LatestRevisionDate: 1/12/2011
R1 R52 = R0603_33R_1%_0.1W_100PPM: Resistor - 1%; Part Description: General Purpose Thick Film Chip Resistor; Manufacturer: GENERIC; Manufacturer1 Part Number: NRC06F33R0TRF; Power: 0.1W; TC: ±100ppm/°C; Table: Resistors SMD; Part Number: R0603_33R_1%_0.1W_100PPM; Component Kind: Standard; Component Type: Standard; Pin Count: 2; Value: 33; Status: Preferred; Tolerance: ±1%; Manufacturer Part Number: R0603_33R_1%_0.1W_100PPM; Case: 0603; Mounted: Yes; Socket: No; SMD: Yes; Manufacturer1 Example: NIC COMPONENT; Manufacturer1 ComponentHeight: 0.55mm; HelpURL: \\cern.ch\dfs\Applications\Altium\Datasheets\R0603_NIC_NRC.pdf; Author: CERN DEM JLC; CreateDate: 12/3/2007; LatestRevisionDate: 3/13/2008
R2-R8 R10 R13 R14 R21 R23-R28 R33 = R0603_49R9_0.1%_0.063W_10PPM: as R46 on sheet TDC; Part Number: R0603_49R9_0.1%_0.063W_10PPM; Component Kind: Standard; Component Type: Standard; Pin Count: 2; Value: 49R9; Status: Not recommended; Tolerance: ±0.1%; Manufacturer Part Number: R0603_49R9_0.1%_0.063W_10PPM; Case: 0603; Mounted: Yes; Socket: No; SMD: Yes; Manufacturer1 Example: TYCO HOLSWORTHY; Manufacturer1 ComponentHeight: 0.5mm; HelpURL: \\cern.ch\dfs\Applications\Altium\Datasheets\R0603_Tyco_RN73.pdf; Author: CERN DEM JLC; CreateDate: 12/3/2007; LatestRevisionDate: 3/13/2008
R11 R53 = R0603_2K2_1%_0.1W_100PPM: as R20 on sheet TDC; Part Number: R0603_2K2_1%_0.1W_100PPM; Component Kind: Standard; Component Type: Standard; Pin Count: 2; Value: 2k2; Status: Preferred; Tolerance: ±1%; Manufacturer Part Number: R0603_2K2_1%_0.1W_100PPM; Case: 0603; Mounted: Yes; Socket: No; SMD: Yes; Manufacturer1 Example: NIC COMPONENT; Manufacturer1 ComponentHeight: 0.55mm; HelpURL: \\cern.ch\dfs\Applications\Altium\Datasheets\R0603_NIC_NRC.pdf; Author: CERN DEM JLC; CreateDate: 12/3/2007; LatestRevisionDate: 3/13/2008

## Sheet OUTPUT_BUFFER.SchDoc: Output buffer
size 297 x 209 mm; CheckedBy: -; CompanyName: CERN; DrawnBy: GK; Organization: CERN; Address1: European Organization for Nuclear Research; Address2: CH-1211 Geneve 23 - Switzerland; Revision: -; SheetNumber: 9; SheetTotal: 9; EDA_Number: EDA-XXXXX-VX-X; Projet: FMC Delay 1ns 4cha; ModifiedBy: -; CreateDate: XX/XX/XXXX; CheckedDate: -; Title2: Title2; DivGrp: BE-CO; Designer: GK; ModifiedDate: -
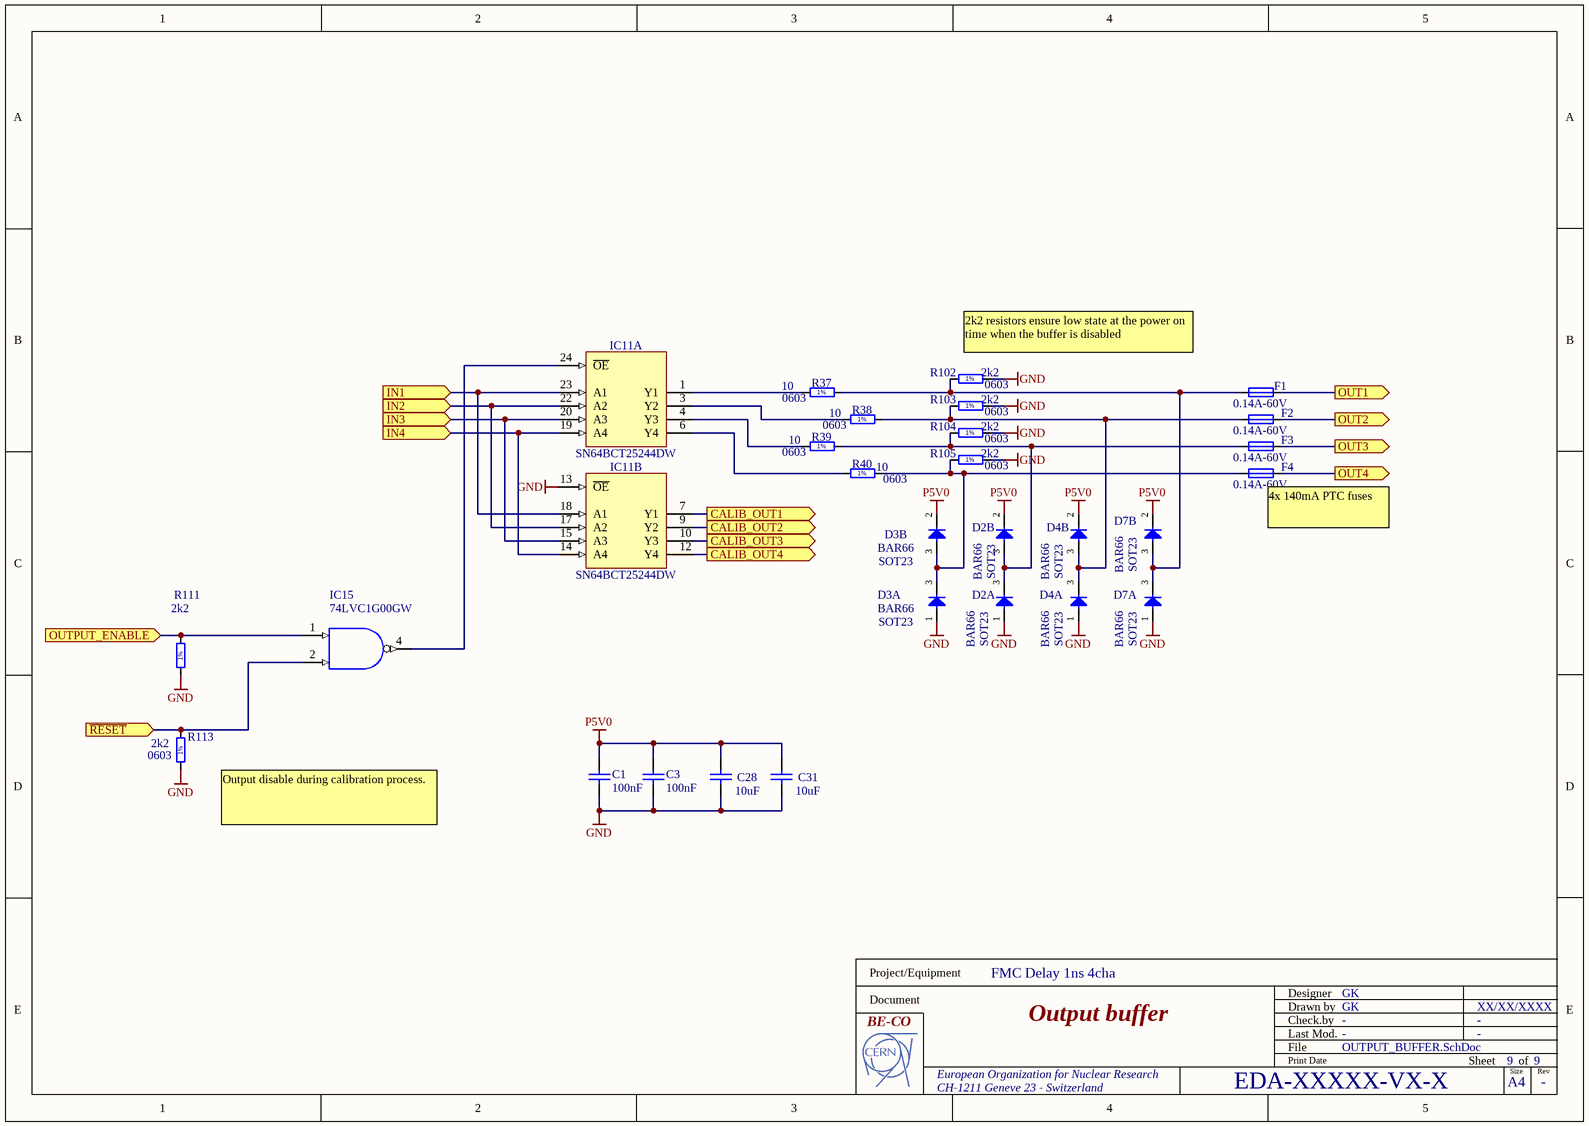
[diagram p6: OUTPUT_BUFFER.SchDoc]

### Parts
C1  100nF  [CAPC1608X87N]
C3  100nF  [CAPC1608X87N]
C28  10uF  [CAPC2012X135N]
C31  10uF  [CAPC2012X135N]
D2  BAR66  Case: SOT23  [SOT95P240X110-3N]  (parts A,B of 2)
D3  BAR66  Case: SOT23  [SOT95P240X110-3N]  (parts A,B of 2)
D4  BAR66  Case: SOT23  [SOT95P240X110-3N]  (parts A,B of 2)
D7  BAR66  Case: SOT23  [SOT95P240X110-3N]  (parts A,B of 2)
F1  0.14A-60V  [FUSRC4632X90N]
F2  0.14A-60V  [FUSRC4632X90N]
F3  0.14A-60V  [FUSRC4632X90N]
F4  0.14A-60V  [FUSRC4632X90N]
IC11  SN64BCT25244DW  [SOIC127P1030X265-24N]  (parts A,B of 2)
IC15  74LVC1G00GW  [SOT65P212X110-5N]
R37  10  Case: 0603  [RESC1608X55N]
R38  10  Case: 0603  [RESC1608X55N]
R39  10  Case: 0603  [RESC1608X55N]
R40  10  Case: 0603  [RESC1608X55N]
R102  2k2  Case: 0603  [RESC1608X55N]
R103  2k2  Case: 0603  [RESC1608X55N]
R104  2k2  Case: 0603  [RESC1608X55N]
R105  2k2  Case: 0603  [RESC1608X55N]
R111  2k2  [RESC1608X55N]
R113  2k2  Case: 0603  [RESC1608X55N]

### Ports
CALIB_OUT1 (out), CALIB_OUT2 (out), CALIB_OUT3 (out), CALIB_OUT4 (out), IN1 (in), IN2 (in), IN3 (in), IN4 (in), OUT1 (out), OUT2 (out), OUT3 (out), OUT4 (out), OUTPUT_ENABLE (in), ~{RESET} (in)

### Nets
GND: C1.2 C3.2 C28.1 C31.1 D2.1(A) D3.1(A) D4.1(A) D7.1(A) IC11.2(GND) IC11.5(GND) IC11.8(GND) IC11.11(GND) IC11.13(~{OE}) IC15.3(GND) R102.2 R103.2 R104.2 R105.2 R111.1 R113.1
P3V3: IC15.5(VCC)
P5V0: C1.1 C3.1 C28.2 C31.2 D2.2(C) D3.2(C) D4.2(C) D7.2(C) IC11.16(VCC) IC11.21(VCC)
OUTPUT_ENABLE: IC15.1(A) R111.2 ; port OUTPUT_ENABLE
RESETn: IC15.2(B) R113.2 ; port ~{RESET}
TDC_CAL_STOP1: IC11.7(Y1) ; port CALIB_OUT1
TDC_CAL_STOP2: IC11.9(Y2) ; port CALIB_OUT2
TDC_CAL_STOP3: IC11.10(Y3) ; port CALIB_OUT3
TDC_CAL_STOP4: IC11.12(Y4) ; port CALIB_OUT4
NetD2_3: D2.3(COMAC) F3.1 R39.2 R104.1
NetD3_3: D3.3(COMAC) F4.1 R40.2 R105.1
NetD4_3: D4.3(COMAC) F2.1 R38.2 R103.1
NetD7_3: D7.3(COMAC) F1.1 R37.2 R102.1
NetF1_2: F1.2 ; port OUT1
NetF2_2: F2.2 ; port OUT2
NetF3_2: F3.2 ; port OUT3
NetF4_2: F4.2 ; port OUT4
NetIC1A_6: IC11.17(A2) IC11.22(A2) ; port IN2
NetIC1A_7: IC11.18(A1) IC11.23(A1) ; port IN1
NetIC1B_6: IC11.14(A4) IC11.19(A4) ; port IN4
NetIC1B_7: IC11.15(A3) IC11.20(A3) ; port IN3
NetIC11_1: IC11.1(Y1) R37.1
NetIC11_3: IC11.3(Y2) R38.1
NetIC11_4: IC11.4(Y3) R39.1
NetIC11_6: IC11.6(Y4) R40.1
NetIC11_24: IC11.24(~{OE}) IC15.4(Y)

### Notes on the sheet
- (near R102) 2k2 resistors ensure low state at the power on time when the buffer is disabled
- (near F4) 4x 140mA PTC fuses
- (near R113) Output disable during calibration process.
- Project/Equipment
- Document
- Output buffer
- Designer
- Drawn by
- Check.by
- File
- Last Mod.
- Print Date
- Sheet
- Size
- A4
- of
- Rev
- (in symbol R0603_2K2_1%_0.1W_100PPM) 1%
- (in symbol R0603_10R_1%_0.1W_200PPM) 1%

### Library data of the parts
C1 C3 = CC0603_100NF_50V_10%_X7R: Non-polarised capacitor; Manufacturer1 Part Number: 223858615649; Manufacturer: GENERIC; Part Description: SMD Multilayer Chip Ceramic Capacitor; Table: Capacitors SMD; TC: X7R; Tolerance: ±10%; Voltage: 50V; Author: CERN DEM JLC; Case: 0603; Component Type: Standard; CreateDate: 12/3/2007; HelpURL: \\cern.ch\dfs\Applications\Altium\Datasheets\CC0603_X7R_PHYCOMP.pdf; LatestRevisionDate: 12/3/2007; Manufacturer1 ComponentHeight: 0.87mm; Manufacturer1 Example: PHYCOMP; Manufacturer Part Number: CC0603_100NF_50V_10%_X7R; Mounted: Yes; Pin Count: 2; SMD: Yes; Socket: No; Status: Preferred; Value: 100nF; Part Number: CC0603_100NF_50V_10%_X7R; Component Kind: Standard
C28 C31 = CC0805_10UF_16V_10%_X5R: Non-polarised capacitor; Part Description: SMD Multilayer Chip Ceramic Capacitor; Manufacturer: GENERIC; Manufacturer1 Part Number: C0805C106K4PAC; Voltage: 16V; TC: X5R; Tolerance: ±10%; Table: Capacitors SMD; Part Number: CC0805_10UF_16V_10%_X5R; Component Kind: Standard; Component Type: Standard; Pin Count: 2; Value: 10uF; Status: Preferred; Manufacturer Part Number: CC0805_10UF_16V_10%_X5R; Case: 0805; Mounted: Yes; Socket: No; SMD: Yes; Manufacturer1 Example: KEMET; Manufacturer1 ComponentHeight: 1.4mm; HelpURL: \\cern.ch\dfs\Applications\Altium\Datasheets\CC1206_X5R_KEMET.pdf; Author: CERN DEM JLC; CreateDate: 12/3/2007; LatestRevisionDate: 12/3/2007
D2-D4 D7 = BAR66: Serial Diode; Part Description: Silicon PIN Diode Array (Series Connected); Manufacturer: INFINEON; Voltage: 150V; Power: 250mA; Table: Diodes; Part Number: BAR66; Component Kind: Standard; Component Type: Standard; Device: BAR66; PackageDescription: SOT23 3-Leads, Pitch 0.95mm - Body 1.3x2.9mm, IPC Medium Density; Manufacturer Part Number: BAR66; Pin Count: 3; Mounted: Yes; Socket: No; SMD: Yes; ComponentHeight: 1.1mm; HelpURL: \\cern.ch\dfs\Applications\Altium\Datasheets\BAR66.pdf; Author: CERN DEM JLC; CreateDate: 1/18/2010; LatestRevisionDate: 10/5/2010
F1-F4 = FUSR1812_TYCO-miniSMD0114F: Fuse; Part Description: PolySwitch® PTC Overcurrent Protection Device; Manufacturer: TYCO ELECTRONICS; Manufacturer Part Number: miniSMDC014F; Table: Fuses; Part Number: FUSR1812_TYCO-miniSMD0114F; Component Kind: Standard; Component Type: Standard; Pin Count: 2; PackageDescription: Chip Resettable Fuse, 2-Leads, Body 4.6x3.2mm, IPC Medium Density; Family: Fuses Resettable; Mounted: Yes; Socket: No; SMD: Yes; Value: 0.14A-60V; ComponentHeight: 0.89mm; HelpURL: \\cern.ch\dfs\Applications\Altium\Datasheets\FUSR_TYCO_MiniSMD0114F.pdf; Author: CERN DEM JLC; CreateDate: 7/2/2008; LatestRevisionDate: 3/17/2010
IC11 = SN64BCT25244DW: 25-Ohm Octal Buffer/Driver with 3-State Outputs; Part Description: 25-Ohms Octal Buffer/Driver with 3-State Outputs; Manufacturer: TEXAS INSTRUMENTS; Table: Standard Logic; Part Number: SN64BCT25244DW; Component Kind: Standard; Component Type: Standard; Device: SN64BCT25244DW; PackageDescription: SOIC 24, Pitch 1.27mm - Body 7.6x15.6mm, IPC Medium Density; Manufacturer Part Number: SN64BCT25244DW; Pin Count: 24; Case: SOIC24; Mounted: Yes; Socket: No; SMD: Yes; ComponentHeight: 2.65mm; Author: CERN DEM JLC; HelpURL: \\cern.ch\dfs\Applications\Altium\Datasheets\SN64BCT25244DW.pdf; CreateDate: 3/30/2009; LatestRevisionDate: 4/27/2010
IC15 = 74LVC1G00GW: Single 2-Input NAND Gate; Manufacturer: NXP SEMICONDUCTORS; Table: Standard Logic; Part Number: 74LVC1G00GW; Component Kind: Standard; Component Type: Standard; Device: 74LVC1G00GW; PackageDescription: SOT353, SOT, 0.65mm Pitch, 5 pin, 1.25mm W X 2.05mm L X 1.10mm H, IPC Medium Density; Part Description: Single 2-Input NAND Gate; Manufacturer Part Number: 74LVC1G00GW; Pin Count: 3; Case: SOT353; Mounted: Yes; Socket: No; SMD: Yes; ComponentHeight: 1.1mm; Author: CERN DEM JLC; HelpURL: \\cern.ch\dfs\Applications\Altium\Datasheets\74LVC1G00GW.pdf; CreateDate: 1/13/2009; LatestRevisionDate: 3/3/2010
R37-R40 = R0603_10R_1%_0.1W_200PPM: Resistor - 1%; Part Description: General Purpose Thick Film Chip Resistor; Manufacturer: GENERIC; Manufacturer1 Part Number: NRC06F10R0TRF; Power: 0.1W; TC: ±200ppm/°C; Table: Resistors SMD; Part Number: R0603_10R_1%_0.1W_200PPM; Component Kind: Standard; Component Type: Standard; Pin Count: 2; Value: 10; Status: Preferred; Tolerance: ±1%; Manufacturer Part Number: R0603_10R_1%_0.1W_200PPM; Mounted: Yes; Socket: No; SMD: Yes; Manufacturer1 Example: NIC COMPONENT; Manufacturer1 ComponentHeight: 0.55mm; HelpURL: \\cern.ch\dfs\Applications\Altium\Datasheets\R0603_NIC_NRC.pdf; Author: CERN DEM JLC; CreateDate: 12/3/2007; LatestRevisionDate: 6/24/2009
R102-R105 R111 R113 = R0603_2K2_1%_0.1W_100PPM: Resistor - 1%; Part Description: General Purpose Thick Film Chip Resistor; Manufacturer: GENERIC; Manufacturer1 Part Number: NRC06F2201TRF; Power: 0.1W; TC: ±100ppm/°C; Table: Resistors SMD; Part Number: R0603_2K2_1%_0.1W_100PPM; Component Kind: Standard; Component Type: Standard; Pin Count: 2; Value: 2k2; Status: Preferred; Tolerance: ±1%; Manufacturer Part Number: R0603_2K2_1%_0.1W_100PPM; Mounted: Yes; Socket: No; SMD: Yes; Manufacturer1 Example: NIC COMPONENT; Manufacturer1 ComponentHeight: 0.55mm; HelpURL: \\cern.ch\dfs\Applications\Altium\Datasheets\R0603_NIC_NRC.pdf; Author: CERN DEM JLC; CreateDate: 12/3/2007; LatestRevisionDate: 3/13/2008
  R111: Case: 0603

## Sheet INPUT_LOGIC.SchDoc: Input logic
size 297 x 209 mm; CheckedBy: -; CompanyName: CERN; DrawnBy: GK, TW; Organization: CERN; Address1: European Organization for Nuclear Research; Address2: CH-1211 Geneve 23 - Switzerland; DocumentNumber: 5; Revision: -; SheetNumber: 6; SheetTotal: 9; EDA_Number: EDA-02667-V2-0; Projet: FMC Delay 1ns 4cha; ModifiedBy: -; CheckedDate: -; DivGrp: BE-CO; Designer: GK, TW; ModifiedDate: -
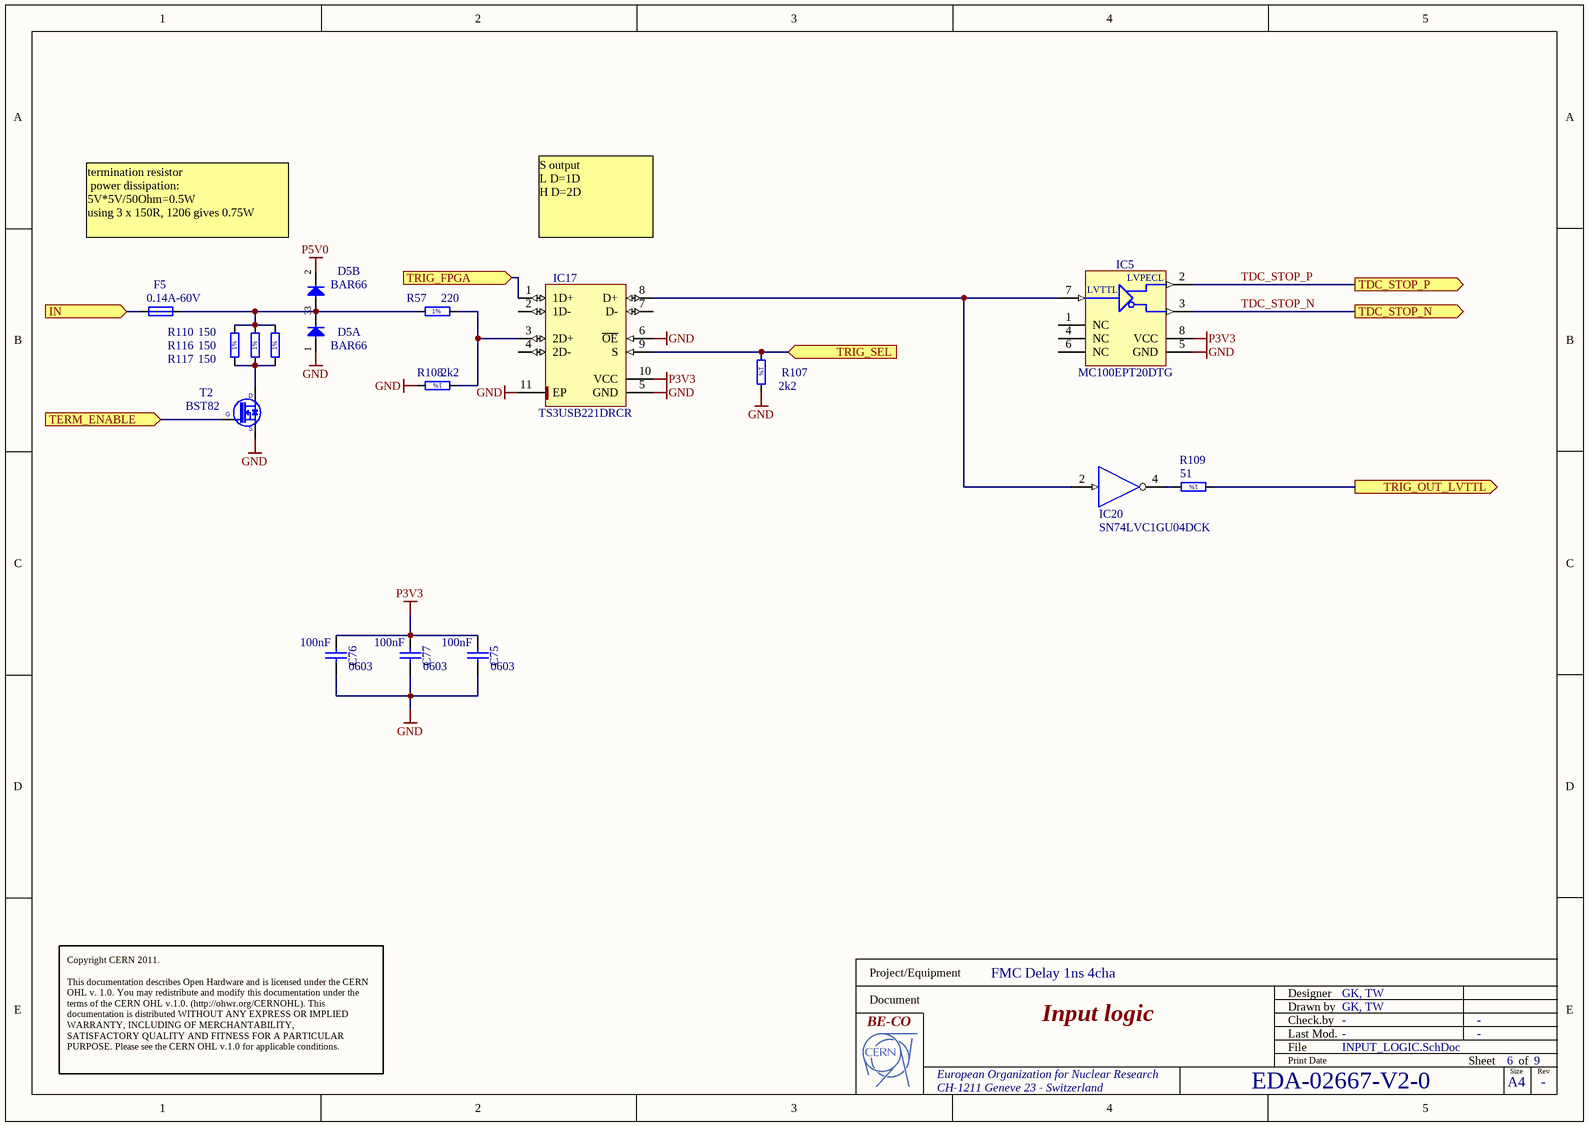
[diagram p7: INPUT_LOGIC.SchDoc]

### Parts
C75  100nF  Case: 0603  [CAPC1608X87N]
C76  100nF  Case: 0603  [CAPC1608X87N]
C77  100nF  Case: 0603  [CAPC1608X87N]
D5  BAR66  [SOT95P240X110-3N]  (parts A,B of 2)
F5  0.14A-60V  [FUSRC4632X90N]
IC5  MC100EPT20DTG  [SOP65P490X110-8N]
IC17  TS3USB221DRCR  [SON50P300X300X100-11N-R175X250]
IC20  SN74LVC1GU04DCK  [SOT65P210X110-5N]
R57  220  [RESC1608X55N]
R107  2k2  [RESC1608X55N]
R108  2k2  [RESC1608X55N]
R109  51  [RESC1608X55N]
R110  150  [RESC3216X65N]
R116  150  [RESC3216X65N]
R117  150  [RESC3216X65N]
T2  BST82  [SOT95P240X110-3N]

### Ports
IN (in), TDC_STOP_N (out), TDC_STOP_P (out), TERM_ENABLE (in), TRIG_FPGA (in), TRIG_OUT_LVTTL (out), TRIG_SEL (in)

### Nets
GND: C75.2 C76.2 C77.2 D5.1(A) IC5.5(GND) IC17.5(GND) IC17.6(~{OE}) IC17.11(EP) IC20.3(GND) R107.2 R108.2 T2.2(S)
P3V3: C75.1 C76.1 C77.1 IC5.8(VCC) IC17.10(VCC) IC20.5(VCC)
P5V0: D5.2(C)
TDC_STOP_N: IC5.3(~{Q}) ; port TDC_STOP_N
TDC_STOP_P: IC5.2(Q) ; port TDC_STOP_P
TERM_ENABLE: T2.1(G) ; port TERM_ENABLE
TRIG_OUT_LVTTL: R109.1 ; port TRIG_OUT_LVTTL
TRIG_SEL: IC17.9(S) R107.1 ; port TRIG_SEL
NetD5_3: D5.3(COMAC) F5.2 R57.1 R110.2 R116.2 R117.2
NetF5_1: F5.1 ; port IN
NetIC5_7: IC5.7(D) IC17.8(D+) IC20.2(IN)
NetIC17_1: IC17.1(1D+) ; port TRIG_FPGA
NetIC17_3: IC17.3(2D+) R57.2 R108.1
NetIC20_4: IC20.4(OUT) R109.2
NetR110_1: R110.1 R116.1 R117.1 T2.3(D)

Not connected (* = marked no-connect by the designer): IC5 1(NC) 4(NC) 6(NC); IC17 2(1D-) 4(2D-) 7(D-)

### Notes on the sheet
- termination resistor
  power dissipation:
  5V*5V/50Ohm=0.5W
  using 3 x 150R, 1206 gives 0.75W
- S	output
  L	D=1D
  H	D=2D
- Copyright CERN 2011.
  This documentation describes Open Hardware and is licensed under the CERN OHL v. 1.0. You may redistribute and modify this documentation under the terms of the CERN OHL v.1.0. (http://ohwr.org/CERNOHL). This documentation is distributed WITHOUT ANY EXPRESS OR IMPLIED WARRANTY, INCLUDING OF MERCHANTABILITY, SATISFACTORY QUALITY AND FITNESS FOR A PARTICULAR PURPOSE. Please see the CERN OHL v.1.0 for applicable conditions.
- Project/Equipment
- Document
- Designer
- Drawn by
- Check.by
- File
- Last Mod.
- Print Date
- Sheet
- Size
- A4
- of
- Rev
- (in symbol MC100EPT20DTG) LVPECL; LVTTL
- (in symbol R0603_2K2_1%_0.1W_100PPM) 1%
- (in symbol R0603_51R_1%_0.1W_100PPM) 1%
- (in symbol R0603_220R_1%_0.1W_100PPM) 1%
- (in symbol R1206_150R_1%_0.25W_100PPM) 1%

### Library data of the parts
C75-C77 = CC0603_100NF_50V_10%_X7R: Non-polarised capacitor; Part Description: SMD Multilayer Chip Ceramic Capacitor; Manufacturer: GENERIC; Manufacturer1 Part Number: 223858615649; Voltage: 50V; TC: X7R; Tolerance: ±10%; Table: Capacitors SMD; Part Number: CC0603_100NF_50V_10%_X7R; Component Kind: Standard; Component Type: Standard; Pin Count: 2; Value: 100nF; Status: Preferred; Manufacturer Part Number: CC0603_100NF_50V_10%_X7R; Mounted: Yes; Socket: No; SMD: Yes; Manufacturer1 Example: PHYCOMP; Manufacturer1 ComponentHeight: 0.87mm; HelpURL: \\cern.ch\dfs\Applications\Altium\Datasheets\CC0603_X7R_PHYCOMP.pdf; Author: CERN DEM JLC; CreateDate: 12/3/2007; LatestRevisionDate: 12/3/2007
D5 = BAR66: as D2-D4 on sheet OUTPUT_BUFFER; Part Number: BAR66; Component Kind: Standard; Component Type: Standard; Device: BAR66; PackageDescription: SOT23 3-Leads, Pitch 0.95mm - Body 1.3x2.9mm, IPC Medium Density; Manufacturer Part Number: BAR66; Pin Count: 3; Case: SOT23; Mounted: Yes; Socket: No; SMD: Yes; ComponentHeight: 1.1mm; HelpURL: \\cern.ch\dfs\Applications\Altium\Datasheets\BAR66.pdf; Author: CERN DEM JLC; CreateDate: 1/18/2010; LatestRevisionDate: 10/5/2010
F5 = FUSR1812_TYCO-miniSMD0114F: as F1 on sheet OUTPUT_BUFFER; Part Number: FUSR1812_TYCO-miniSMD0114F; Component Kind: Standard; Component Type: Standard; Pin Count: 2; PackageDescription: Chip Resettable Fuse, 2-Leads, Body 4.6x3.2mm, IPC Medium Density; Family: Fuses Resettable; Mounted: Yes; Socket: No; SMD: Yes; Value: 0.14A-60V; ComponentHeight: 0.89mm; HelpURL: \\cern.ch\dfs\Applications\Altium\Datasheets\FUSR_TYCO_MiniSMD0114F.pdf; Author: CERN DEM JLC; CreateDate: 7/2/2008; LatestRevisionDate: 3/17/2010
IC5 = MC100EPT20DTG: 3.3V LVTTL/LVCMOS to Differential LVPECL Translator; Manufacturer: ON SEMICONDUCTOR; Table: Standard Logic; Part Number: MC100EPT20DTG; Component Kind: Standard; Component Type: Standard; Device: MC100EPT20DTG; PackageDescription: SOP, 0.65mm pitch; 8 pin, 3.00mm W X 3.00mm L X 1.10mm H body, IPC Medium Density; Part Description: 3.3V LVTTL/LVCMOS To Differential LVPECL Translator; Manufacturer Part Number: MC100EPT20DTG; Pin Count: 8; Case: SOIC8; Mounted: Yes; Socket: No; SMD: Yes; ComponentHeight: 1.1mm; Author: CERN DEM JLC; HelpURL: \\cern.ch\dfs\Applications\Altium\Datasheets\MC100EPT20DTG.pdf; CreateDate: 7/5/2010; LatestRevisionDate: 7/5/2010
IC17 = TS3USB221DRCR: High-Speed USB 2.0 (480-Mbps) 1:2 Multiplexer/Demultiplexer Switch With Single Enable; Manufacturer: TEXAS INSTRUMENTS; Table: Analog & Interface; Part Number: TS3USB221DRCR; Component Kind: Standard; Component Type: Standard; Device: TS3USB221DRCR; PackageDescription: SON, 0.50mm Pitch, 10-pin, 3.00mm W  X 3.00mm L X 1.00mm Height, (w/thermal tab 1.75 X 2.50 mm), IPC Medium Density; Part Description: High-Speed USB 2.0 (480-Mbps) 1:2 Multiplexer/Demultiplexer Switch With Single Enable; Manufacturer Part Number: TS3USB221DRCR; Pin Count: 11; Case: SON10; Mounted: Yes; Socket: No; SMD: Yes; ComponentHeight: 1mm; Author: CERN DEM JLC; HelpURL: \\cern.ch\dfs\Applications\Altium\Datasheets\TS3USB221DRCR.pdf; CreateDate: 8/25/2010; LatestRevisionDate: 8/25/2010
IC20 = SN74LVC1GU04DCK: Single Inverter Buffer; Part Description: Single Inverter Gate; Manufacturer: TEXAS INSTRUMENTS; Table: Standard Logic; Part Number: SN74LVC1GU04DCK; Component Kind: Standard; Component Type: Standard; Device: SN74LVC1GU04DCK; PackageDescription: SOT353, SC70-5, SOT, 0.65mm Pitch, 5 pin, 1.25mm W X 2.00mm L X 1.10mm H, IPC Medium Density; Manufacturer Part Number: SN74LVC1GU04DCK; Pin Count: 2; Case: SOT353; Mounted: Yes; Socket: No; SMD: Yes; ComponentHeight: 1.1mm; Author: CERN DEM JLC; HelpURL: \\cern.ch\dfs\Applications\Altium\Datasheets\SN74LVC1GU04DCK.pdf; CreateDate: 2/16/2011; LatestRevisionDate: 2/16/2011
R57 = R0603_220R_1%_0.1W_100PPM: Resistor - 1%; Part Description: General Purpose Thick Film Chip Resistor; Manufacturer: GENERIC; Manufacturer1 Part Number: NRC06F2200TRF; Power: 0.1W; TC: ±100ppm/°C; Table: Resistors SMD; Part Number: R0603_220R_1%_0.1W_100PPM; Component Kind: Standard; Component Type: Standard; Pin Count: 2; Value: 220; Status: Preferred; Tolerance: ±1%; Manufacturer Part Number: R0603_220R_1%_0.1W_100PPM; Case: 0603; Mounted: Yes; Socket: No; SMD: Yes; Manufacturer1 Example: NIC COMPONENT; Manufacturer1 ComponentHeight: 0.55mm; HelpURL: \\cern.ch\dfs\Applications\Altium\Datasheets\R0603_NIC_NRC.pdf; Author: CERN DEM JLC; CreateDate: 12/3/2007; LatestRevisionDate: 3/13/2008
R107 R108 = R0603_2K2_1%_0.1W_100PPM: as R102-R105 on sheet OUTPUT_BUFFER; Part Number: R0603_2K2_1%_0.1W_100PPM; Component Kind: Standard; Component Type: Standard; Pin Count: 2; Value: 2k2; Status: Preferred; Tolerance: ±1%; Manufacturer Part Number: R0603_2K2_1%_0.1W_100PPM; Case: 0603; Mounted: Yes; Socket: No; SMD: Yes; Manufacturer1 Example: NIC COMPONENT; Manufacturer1 ComponentHeight: 0.55mm; HelpURL: \\cern.ch\dfs\Applications\Altium\Datasheets\R0603_NIC_NRC.pdf; Author: CERN DEM JLC; CreateDate: 12/3/2007; LatestRevisionDate: 3/13/2008
R109 = R0603_51R_1%_0.1W_100PPM: Resistor - 1%; Part Description: General Purpose Thick Film Chip Resistor; Manufacturer: GENERIC; Manufacturer1 Part Number: NRC06F51R0TRF; Power: 0.1W; TC: ±100ppm/°C; Table: Resistors SMD; Part Number: R0603_51R_1%_0.1W_100PPM; Component Kind: Standard; Component Type: Standard; Pin Count: 2; Value: 51; Status: Preferred; Tolerance: ±1%; Manufacturer Part Number: R0603_51R_1%_0.1W_100PPM; Case: 0603; Mounted: Yes; Socket: No; SMD: Yes; Manufacturer1 Example: NIC COMPONENT; Manufacturer1 ComponentHeight: 0.55mm; HelpURL: \\cern.ch\dfs\Applications\Altium\Datasheets\R0603_NIC_NRC.pdf; Author: CERN DEM JLC; CreateDate: 12/3/2007; LatestRevisionDate: 3/13/2008
R110 R116 R117 = R1206_150R_1%_0.25W_100PPM: Resistor - 1%; Part Description: General Purpose Thick Film Chip Resistor; Manufacturer: GENERIC; Manufacturer1 Part Number: NRC12F1500TRF; Power: 0.25W; TC: ±100ppm/°C; Table: Resistors SMD; Part Number: R1206_150R_1%_0.25W_100PPM; Component Kind: Standard; Component Type: Standard; Pin Count: 2; Value: 150; Status: Preferred; Tolerance: ±1%; Manufacturer Part Number: R1206_150R_1%_0.25W_100PPM; Case: 1206; Mounted: Yes; Socket: No; SMD: Yes; Manufacturer1 Example: NIC COMPONENT; Manufacturer1 ComponentHeight: 0.65mm; HelpURL: \\cern.ch\dfs\Applications\Altium\Datasheets\R1206_NIC_NRC.pdf; Author: CERN DEM JLC; CreateDate: 12/3/2007; LatestRevisionDate: 3/13/2008
T2 = BST82: N-CHANNEL MOSFET WITH DIODE; Part Description: 100V 190mA N-Channel Enhancement Mode Field-Effect Transistor; Manufacturer: NXP SEMICONDUCTORS; Table: Transistors; Part Number: BST82; Component Kind: Standard; Component Type: Standard; Device: BST82; PackageDescription: SOT23 3-Leads, Pitch 0.95mm - Body 1.4x3mm, IPC Medium Density; Manufacturer Part Number: BST82; Pin Count: 3; Case: SOT23-3; Mounted: Yes; Socket: No; SMD: Yes; ComponentHeight: 1.1mm; HelpURL: \\cern.ch\dfs\Applications\Altium\Datasheets\BST82.pdf; Author: CERN DEM JLC; CreateDate: 5/14/2008; LatestRevisionDate: 5/14/2008